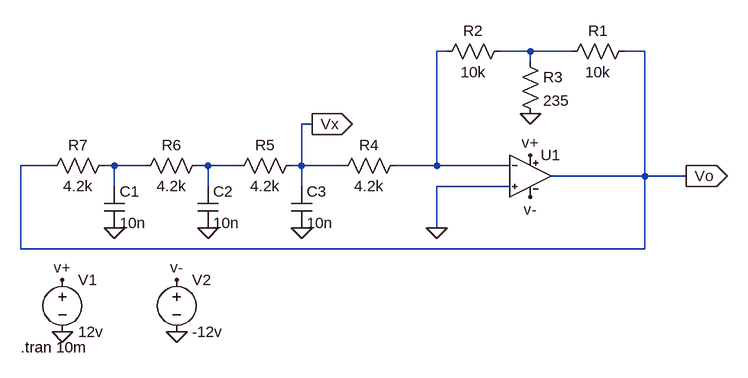
[diagram p0: schematic circuitoAdicionalLAB4.asc]
circuitoAdicionalLAB4.asc, the LTspice schematic file:
Version 4.1
SHEET 1 880 680
WIRE 48 -48 32 -48
WIRE 176 -48 128 -48
WIRE 240 -48 176 -48
WIRE 352 -48 320 -48
WIRE 176 -32 176 -48
WIRE -160 64 -176 64
WIRE -560 128 -608 128
WIRE -464 128 -480 128
WIRE -416 128 -464 128
WIRE -320 128 -336 128
WIRE -272 128 -320 128
WIRE -176 128 -176 64
WIRE -176 128 -192 128
WIRE -112 128 -176 128
WIRE 32 128 32 -48
WIRE 32 128 -32 128
WIRE 144 128 32 128
WIRE 352 144 352 -48
WIRE 352 144 208 144
WIRE 416 144 352 144
WIRE -464 160 -464 128
WIRE -320 160 -320 128
WIRE -176 160 -176 128
WIRE 144 160 32 160
WIRE 32 224 32 160
WIRE -608 256 -608 128
WIRE 352 256 352 144
WIRE 352 256 -608 256
FLAG -464 224 0
FLAG -320 224 0
FLAG -176 224 0
FLAG 32 224 0
FLAG 176 48 0
FLAG -544 384 0
FLAG -368 384 0
FLAG 176 112 v+
FLAG 176 176 v-
FLAG -544 304 v+
FLAG -368 304 v-
FLAG 416 144 Vo
IOPIN 416 144 Out
FLAG -160 64 Vx
IOPIN -160 64 Out
SYMBOL OpAmps\\LM324 176 144 R0
SYMATTR InstName U1
SYMBOL res 160 -48 R0
SYMATTR InstName R3
SYMATTR Value 235
SYMBOL res 144 -64 R90
WINDOW 0 0 56 VBottom 2
WINDOW 3 32 56 VTop 2
SYMATTR InstName R2
SYMATTR Value 10k
SYMBOL res 336 -64 R90
WINDOW 0 0 56 VBottom 2
WINDOW 3 32 56 VTop 2
SYMATTR InstName R1
SYMATTR Value 10k
SYMBOL res -16 112 R90
WINDOW 0 0 56 VBottom 2
WINDOW 3 32 56 VTop 2
SYMATTR InstName R4
SYMATTR Value 4.2k
SYMBOL res -176 112 R90
WINDOW 0 0 56 VBottom 2
WINDOW 3 32 56 VTop 2
SYMATTR InstName R5
SYMATTR Value 4.2k
SYMBOL res -320 112 R90
WINDOW 0 0 56 VBottom 2
WINDOW 3 32 56 VTop 2
SYMATTR InstName R6
SYMATTR Value 4.2k
SYMBOL res -464 112 R90
WINDOW 0 0 56 VBottom 2
WINDOW 3 32 56 VTop 2
SYMATTR InstName R7
SYMATTR Value 4.2k
SYMBOL cap -480 160 R0
SYMATTR InstName C1
SYMATTR Value 10n
SYMBOL cap -336 160 R0
SYMATTR InstName C2
SYMATTR Value 10n
SYMBOL cap -192 160 R0
SYMATTR InstName C3
SYMATTR Value 10n
SYMBOL voltage -544 288 R0
SYMATTR InstName V1
SYMATTR Value 12v
SYMBOL voltage -368 288 R0
SYMATTR InstName V2
SYMATTR Value -12v
TEXT -608 408 Left 2 !.tran 10m

The netlist it stands for:
* circuitoAdicionalLAB4.asc
X§U1 0 N001 v+ v- Vo LM324  ; pins In+ In- V+ V- OUT
R3 N002 0 235
R2 N002 N001 10k
R1 Vo N002 10k
R4 N001 Vx 4.2k
R5 Vx N004 4.2k
R6 N004 N003 4.2k
R7 N003 Vo 4.2k
C1 N003 0 10n
C2 N004 0 10n
C3 Vx 0 10n
V1 v+ 0 12v
V2 v- 0 -12v
.tran 10m
.lib C:\Users\ivan_\OneDrive\Desktop\LM324.lib.txt
.backanno
.end